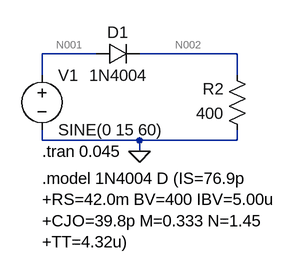
[diagram p0: schematic MediaOnda.asc]
MediaOnda.asc, the LTspice schematic file:
Version 4.1
SHEET 1 1284 680
WIRE 160 112 80 112
WIRE 368 112 224 112
WIRE 80 144 80 112
WIRE 368 144 368 112
WIRE 80 240 80 224
WIRE 224 240 80 240
WIRE 368 240 368 224
WIRE 368 240 224 240
WIRE 224 256 224 240
FLAG 224 256 0
SYMBOL voltage 80 128 R0
WINDOW 123 0 0 Left 0
WINDOW 39 0 0 Left 0
SYMATTR InstName V1
SYMATTR Value SINE(0 15 60)
SYMBOL res 384 240 R180
WINDOW 0 36 76 Left 2
WINDOW 3 36 40 Left 2
SYMATTR InstName R2
SYMATTR Value 400
SYMBOL diode 160 128 R270
WINDOW 0 32 32 VTop 2
WINDOW 3 0 32 VBottom 2
SYMATTR InstName D1
SYMATTR Value 1N4004
TEXT 80 256 Left 2 !.tran 0.045
TEXT 80 296 Left 2 !.model 1N4004 D (IS=76.9p \n+RS=42.0m BV=400 IBV=5.00u \n+CJO=39.8p M=0.333 N=1.45 \n+TT=4.32u)

The netlist it stands for:
* MediaOnda.asc
V1 N001 0 SINE(0 15 60)
R2 0 N002 400
D1 N001 N002 1N4004
.model D D
.lib standard.dio
.tran 0.045
.model 1N4004 D (IS=76.9p
+RS=42.0m BV=400 IBV=5.00u
+CJO=39.8p M=0.333 N=1.45
+TT=4.32u)
.backanno
.end

* Results of the author's LTspice run, read from the files saved beside the schematic
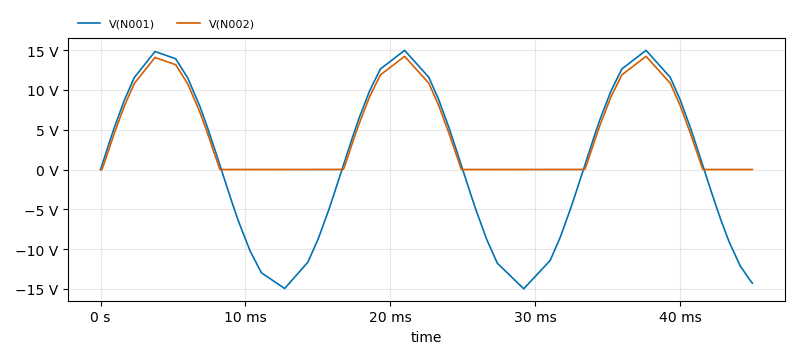
[diagram p1: Transient Analysis of MediaOnda.asc, plotted from the saved traces]
* Transient Analysis, 1 run:
*   V(N001): min -14.98 V, max 14.96 V, average 1.14 V, rms 10.33 V, last -14.27 V
*   V(N002): min -93.03 µV, max 14.21 V, average 4.805 V, rms 7.278 V, last -11.19 µV